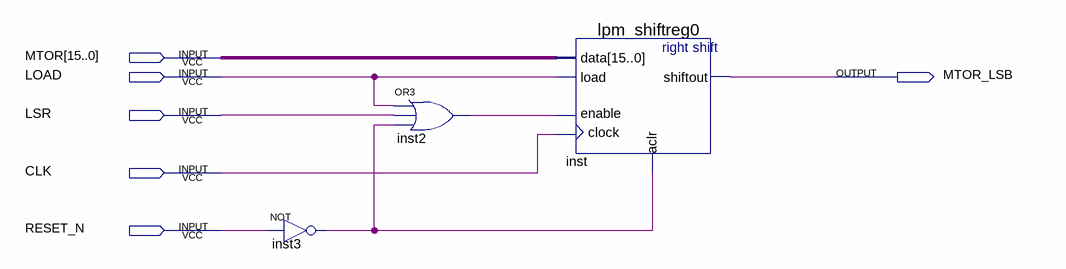
[diagram p0: schematic sheet]
// Quartus schematic shiftreg16right.bdf as structural Verilog: 3 symbols, 6 pins
module shiftreg16right (
  input  [15:0] MTOR,
  input  LOAD,
  input  LSR,
  input  CLK,
  input  RESET_N,
  output MTOR_LSB
);

  wire inst2_out, inst3_out;

  not inst3 (inst3_out, RESET_N);
  or inst2 (inst2_out, LOAD, LSR, inst3_out);
  lpm_shiftreg0 inst (.load(LOAD), .data(MTOR), .clock(CLK), .enable(inst2_out), .aclr(inst3_out), .shiftout(MTOR_LSB));
endmodule
